# Altium project 300W isolated boost.PrjPcb
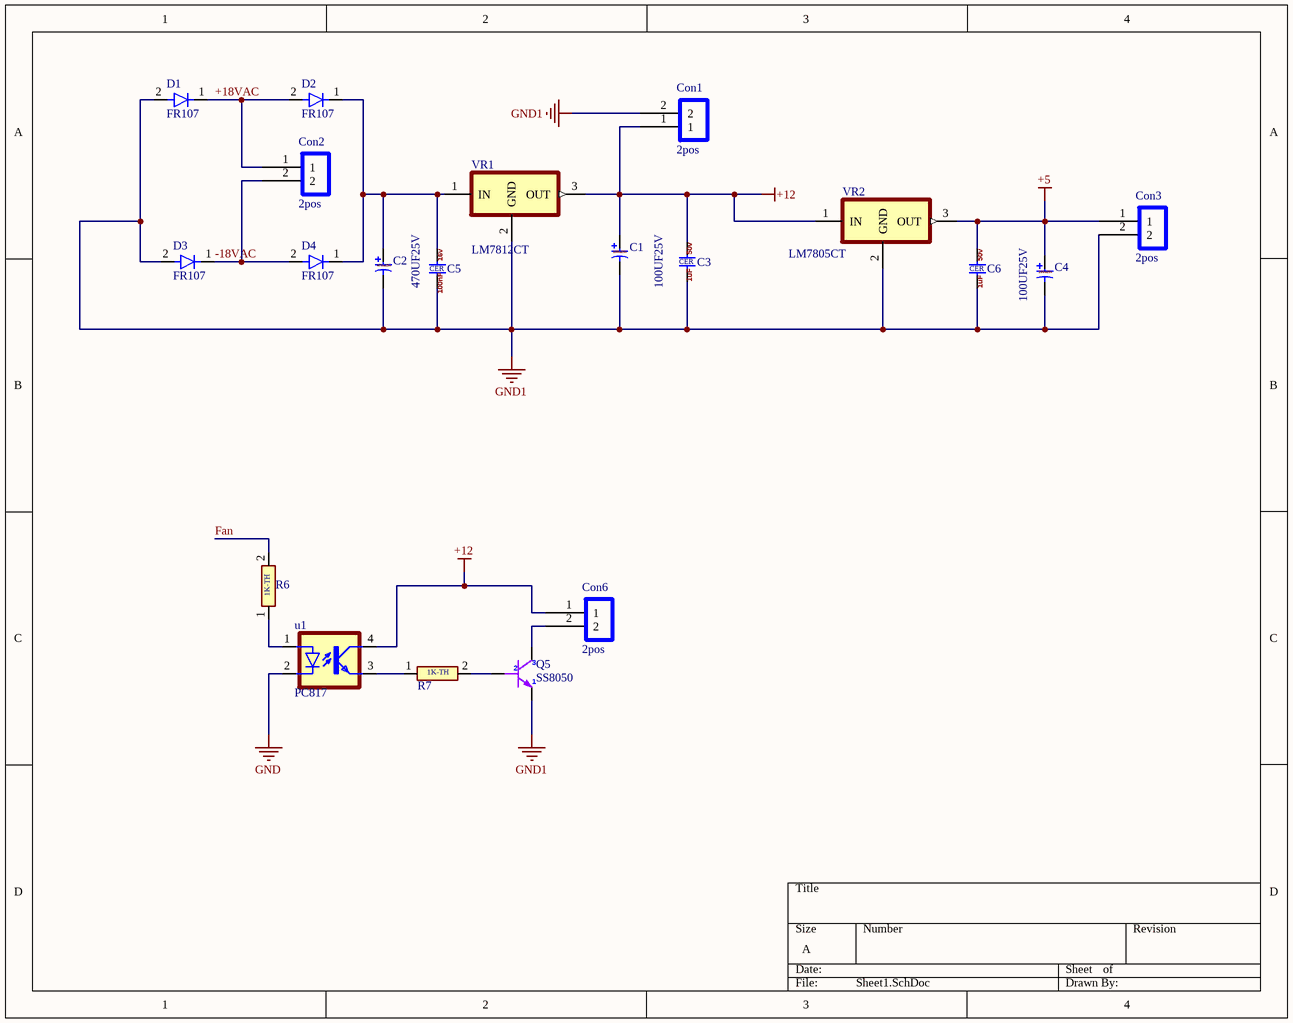
[diagram p0: Sheet1.SchDoc]
2 sheets, 59 parts. Net scope: global (net labels, ports and power ports of the same name join across sheets).
Board file: PCB1.PcbDoc
Sheets:
  Sheet1.SchDoc
  Sheet2.SchDoc

## Sheet Sheet1.SchDoc
size A; SheetNumber: 1; SheetTotal: 2

### Parts
C1  100UF25V  [CAP LS-2.5mm D6.3 H7 - duplicate]
C2  470UF25V  [CAP_RADIAL_D13.0_P5.0_H20.0]
C3  1UFCER  [CAP-CER-2.54]  (value not drawn)
C4  100UF25V  [CAP LS-2.5mm D6.3 H7 - duplicate]
C5  100nFCER  [CAP-CER-2.54]  (value not drawn)
C6  1UFCER  [CAP-CER-2.54]  (value not drawn)
Con1  2pos  [2POS]
Con2  2pos  [2POS]
Con3  2pos  [2POS]
Con6  2pos  [2pos]
D1  FR107  [DIOAD1036W78L470D235]
D2  FR107  [DIOAD1036W78L470D235]
D3  FR107  [DIOAD1036W78L470D235]
D4  FR107  [DIOAD1036W78L470D235]
Q5  SS8050  [TO-92]
R6  1K  [RES-TH-7mm]  (value not drawn)
R7  1K  [RES-TH-7mm]  (value not drawn)
u1  PC817  [DIP-4]
VR1  LM7812CT  [TO254P1054X470X1955-3]
VR2  LM7805CT  [TO254P1054X470X1955-3]

### Nets
+5: C4.1 C6.2 Con3.1 VR2.3(OUT)
+12: C1.1 C3.2 Con1.1 Con6.1 u1.4(COL) VR1.3(OUT) VR2.1(IN)
GND: u1.2(C)
GND1: C1.2 C2.2 C3.1 C4.2 C5.1 C6.1 Con1.2 Con3.2 D1.2 D3.2 Q5.1(E) VR1.2(GND) VR2.2(GND)
+18VAC: Con2.1 D1.1 D2.2
-18VAC: Con2.2 D3.1 D4.2
Fan: R6.2
NetC2_1: C2.1 C5.2 D2.1 D4.1 VR1.1(IN)
NetCon6_2: Con6.2 Q5.3(C)
NetQ5_2: Q5.2(B) R7.2
NetR6_1: R6.1 u1.1(A)
NetR7_1: R7.1 u1.3(EMIT)

### Library data of the parts
C1 C4 = 100UF25V: CAP TH AL: 100U 25V; LCSC Part #: C43351; Unit Price: 0.0057
C2 = 470UF25V: CAP TH AL: 470U 25V; LCSC Part #: C43351; Unit Price: 0.0057
C3 C6 = 1UFCER: CAP: CER 1UF 50V; LCSC Part #: C1848; Unit Price: 0.0104
C5 = 100nFCER: CAP: CER 100nF 16V; LCSC Part #: C1848; Unit Price: 0.0104
Con1-Con3 Con6 = 2pos: P2.54mm
D1-D4 = FR107: DIODE: GEN 1A 1.0V@1A 1kV DO-41 TH; LCSC Part #: C36138; Unit Price: 0.0313
Q5 = SS8050: Transistor: 25V 300mW 120@100mA,1V 1.5A NPN SOT-23; LCSC Part #: C59205; Unit Price: 0.0048
R6 R7 = 1K: RES TH: 1K
u1 = PC817: Optoisolator Transistor Output 5000Vrms 1 Channel 4-DIP
VR1 = LM7812CT: 1.5-A, 12-V, linear voltage regulator; MF: Texas Instruments; MP: LM7812CT/NOPB; SnapEDA_Link: https://www.snapeda.com/parts/LM7812CT/NOPB/Texas+Instruments/view-part/?ref=snap; Package: TO-220-3 Texas Instruments; Value: *; Check_prices: https://www.snapeda.com/parts/LM7812CT/NOPB/Texas+Instruments/view-part/?ref=eda
VR2 = LM7805CT: 1.5-A,  5-V, linear voltage regulator; MF: Texas Instruments; MP: LM7812CT/NOPB; SnapEDA_Link: https://www.snapeda.com/parts/LM7812CT/NOPB/Texas+Instruments/view-part/?ref=snap; Package: TO-220-3 Texas Instruments; Value: *; Check_prices: https://www.snapeda.com/parts/LM7812CT/NOPB/Texas+Instruments/view-part/?ref=eda

## Sheet Sheet2.SchDoc
size A4; SheetNumber: 2; SheetTotal: 2
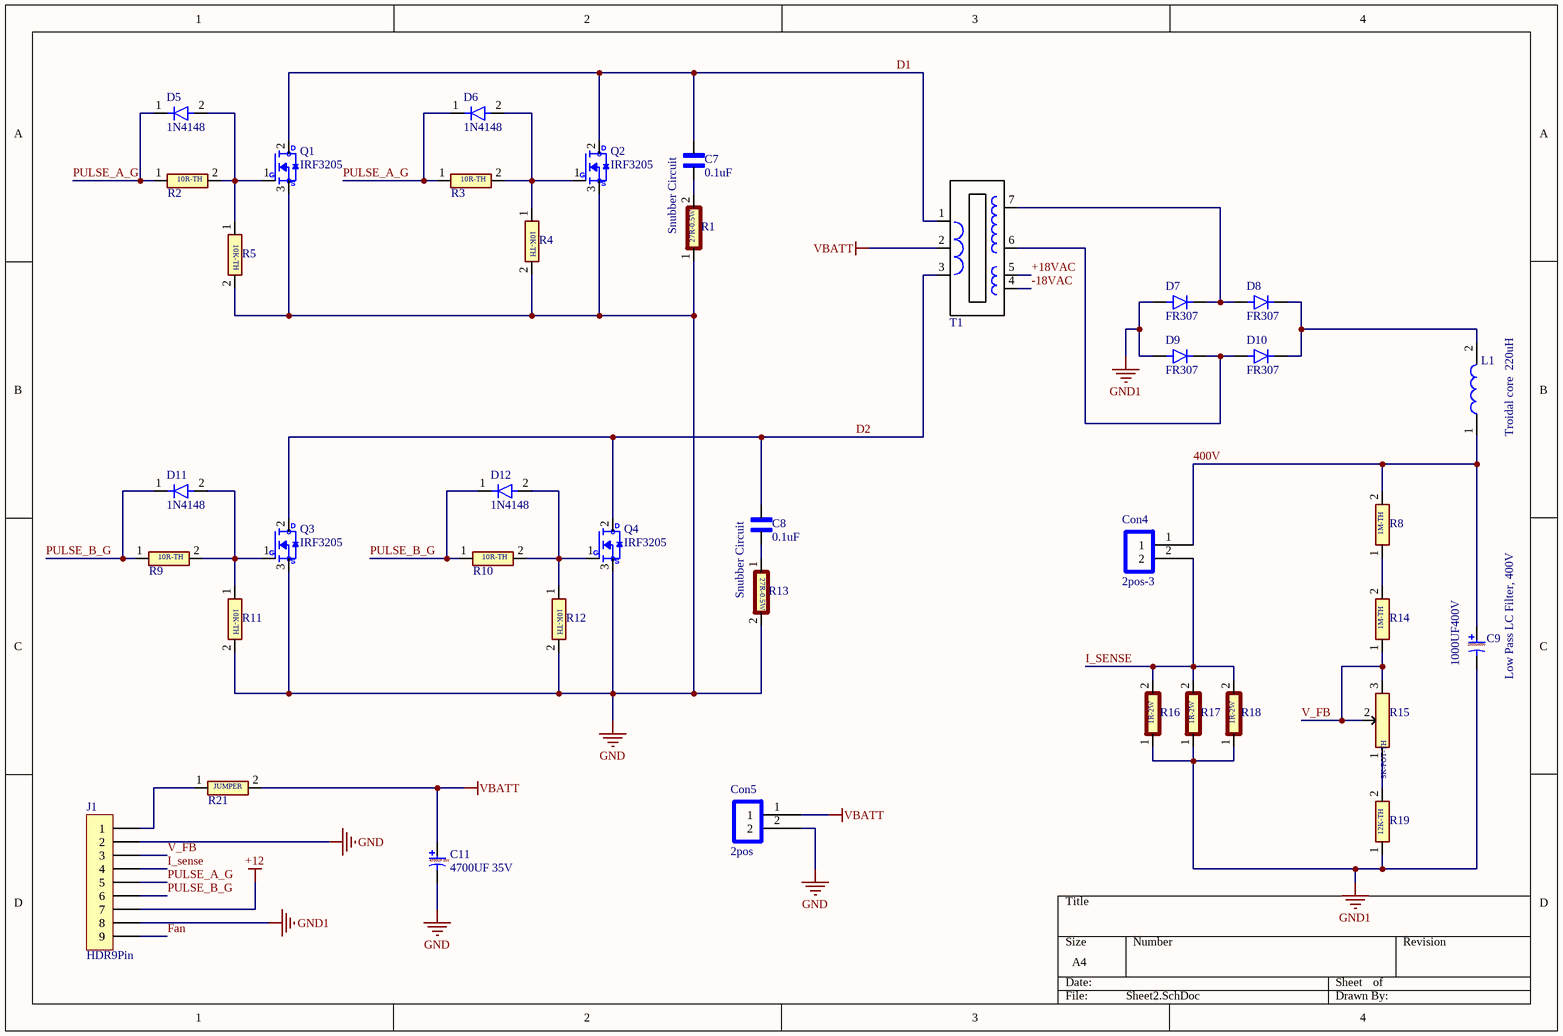
[diagram p1: Sheet2.SchDoc]

### Parts
C7  0.1uF  [CAP_P_9.5MM_Pilm]
C8  0.1uF  [CAP_P_9.5MM_Pilm]
C9  1000UF400V  [CAP-TH_BD35.0-P10.00-D2.3-FD]
C11  4700UF 35V  [CAP-TH_BD18.0-P7.50-D1.2-FD]
Con4  2pos-3  [2POS - 3]
Con5  2pos  [2POS - 3]
D5  1N4148  [DO-35]
D6  1N4148  [DO-35]
D7  FR307  [DO-27_BD5.3-L8.4-P12.40-D1.3-RD]
D8  FR307  [DO-27_BD5.3-L8.4-P12.40-D1.3-RD]
D9  FR307  [DO-27_BD5.3-L8.4-P12.40-D1.3-RD]
D10  FR307  [DO-27_BD5.3-L8.4-P12.40-D1.3-RD]
D11  1N4148  [DO-35]
D12  1N4148  [DO-35]
J1  HDR9Pin  [HDR-TH_9P-P2.54-V-FM]
L1  Troidal core  220uH  [TOROIDAL CORE INDUCTOR]
Q1  IRF3205  [TO-220]
Q2  IRF3205  [TO-220]
Q3  IRF3205  [TO-220]
Q4  IRF3205  [TO-220]
R1  RES-0.5W-27R  [RES_TH 3W]  (value not drawn)
R2  10R  [RES-TH-7mm]  (value not drawn)
R3  10R  [RES-TH-7mm]  (value not drawn)
R4  10K  [RES-TH-7mm]  (value not drawn)
R5  10K  [RES-TH-7mm]  (value not drawn)
R8  1M  [RES-TH-7mm]  (value not drawn)
R9  10R  [RES-TH-7mm]  (value not drawn)
R10  10R  [RES-TH-7mm]  (value not drawn)
R11  10K  [RES-TH-7mm]  (value not drawn)
R12  10K  [RES-TH-7mm]  (value not drawn)
R13  RES-0.5W-27R  [RES_TH 3W]  (value not drawn)
R14  0.5M  [RES-TH-7mm]  (value not drawn)
R15  5K  [TRIM_3296W-1-250]  (value not drawn)
R16  RES-2W-1R  [RES_TH 3W]  (value not drawn)
R17  RES-2W-1R  [RES_TH 3W]  (value not drawn)
R18  RES-2W-1R  [RES_TH 3W]  (value not drawn)
R19  12K  [RES-TH-7mm]  (value not drawn)
R21  0R  [RES-TH-7mm]  (value not drawn)
T1  current transformer  [EE35-FP16]  (value not drawn)

### Nets
+12: J1.7
GND: C11.2 Con5.2 J1.2 Q1.3(S) Q2.3(S) Q3.3(S) Q4.3(S) R1.1 R4.2 R5.2 R11.2 R12.2 R13.2
GND1: C9.2 D7.A D9.A J1.8 R16.1 R17.1 R18.1 R19.1
VBATT: C11.1 Con5.1 R21.2 T1.2
400V: C9.1 Con4.1 L1.1 R8.2
+18VAC: T1.5
-18VAC: T1.4
D1: C7.2 Q1.2(D) Q2.2(D) T1.1
D2: C8.1 Q3.2(D) Q4.2(D) T1.3
Fan: J1.9
I_SENSE: Con4.2 J1.4 R16.2 R17.2 R18.2
PULSE_A_G: D5.1 D6.1 J1.5 R2.1 R3.1
PULSE_B_G: D11.1 D12.1 J1.6 R9.1 R10.1
V_FB: J1.3 R14.1 R15.2 R15.3
NetC7_1: C7.1 R1.2
NetC8_2: C8.2 R13.1
NetD5_2: D5.2 Q1.1(G) R2.2 R5.1
NetD6_2: D6.2 Q2.1(G) R3.2 R4.1
NetD7_C: D7.C(K) D8.A T1.7
NetD8_C: D8.C(K) D10.C(K) L1.2
NetD9_C: D9.C(K) D10.A T1.6
NetD11_2: D11.2 Q3.1(G) R9.2 R11.1
NetD12_2: D12.2 Q4.1(G) R10.2 R12.1
NetJ1_1: J1.1 R21.1
NetR8_1: R8.1 R14.2
NetR15_1: R15.1 R19.2

### Notes on the sheet
- Snubber Circuit
- (near C9) Low Pass LC Filter, 400V
- (in symbol 0.5M) 1M-TH
- (in symbol 0R) JUMPER
- (in symbol 1M) 1M-TH
- (in symbol 5K POT) 5K-POT-TH
- (in symbol 10K) 10K-TH
- (in symbol 10R) 10R-TH
- (in symbol 12K) 12K-TH
- (in symbol 1000UF400V) 1000u400v
- (in symbol RES-0.5W-27R) 27R-0.5W
- (in symbol RES-2W-1R) 1R-2W

### Library data of the parts
C7 C8 = 0.1uF_film: Cap Ceramic 0.1uF 100V X7R 10% Radial 2.54mm 125Â°C T/R; MF: KYOCERA AVX; MP: SR201C104KARTR1; SnapEDA_Link: https://www.snapeda.com/parts/SR201C104KARTR1/Kyocera/view-part/?ref=snap; Package: None; Value: *; Check_prices: https://www.snapeda.com/parts/SR201C104KARTR1/Kyocera/view-part/?ref=eda
C9 = 1000UF400V: CAP TH AL: 1000U 400V; LCSC Part #: C43351; Unit Price: 0.0057
C11 = 4700UF 35V: CAP TH AL: 4700UF 35V; LCSC Part #: C43351; Unit Price: 0.0057
Con4 = 2pos-3: P2.54mm
Con5 = 2pos: P2.54mm
D5 D6 D11 D12 = 1N4148: Rectifier Diode Small Signal Switching 100V 0.3A 4ns 2-Pin DO-35 T/R; LCSC Part #: C36138; Unit Price: 0.0313
D7-D10 = FR307: DIODE: 500ns, 3A, 1000V, Fast Recovery RectifierDO-201AD TH; LCSC Part #: C36138; Unit Price: 0.0313
J1 = HDR9Pin_Females: HEADER: 1*9P Male
L1 = Inductor: Troidal core  inductor: 220uH
Q1-Q4 = IRF3205: MOSFET: N-CH 55V 110A TO-220; LCSC Part #: C274639; Unit Price: 0.2595
R1 R13 = RES-0.5W-27R: RES: 27 OHM 1% 0.5W TH
R2 R3 R9 R10 = 10R: RES TH: 10R
R4 R5 R11 R12 = 10K: RES TH: 10K
R8 = 1M: RES TH: 1M
R14 = 0.5M: RES TH: 0.5M
R15 = 5K POT: RES TH: 5K POT
R16-R18 = RES-2W-1R: RES: 1 OHM 1% 2W TH
R19 = 12K: RES TH: 12K
R21 = 0R: RES TH: JUMPER
T1 = EE35 transformer: ferrite core transformer EE35

## Nets that join several sheets
+12: Sheet1 (7 pins), Sheet2 (J1.7)
GND: Sheet1 (u1.2), Sheet2 (13 pins)
GND1: Sheet1 (13 pins), Sheet2 (8 pins)
+18VAC: Sheet1 (Con2.1 D1.1 D2.2), Sheet2 (T1.5)
-18VAC: Sheet1 (Con2.2 D3.1 D4.2), Sheet2 (T1.4)
Fan: Sheet1 (R6.2), Sheet2 (J1.9)